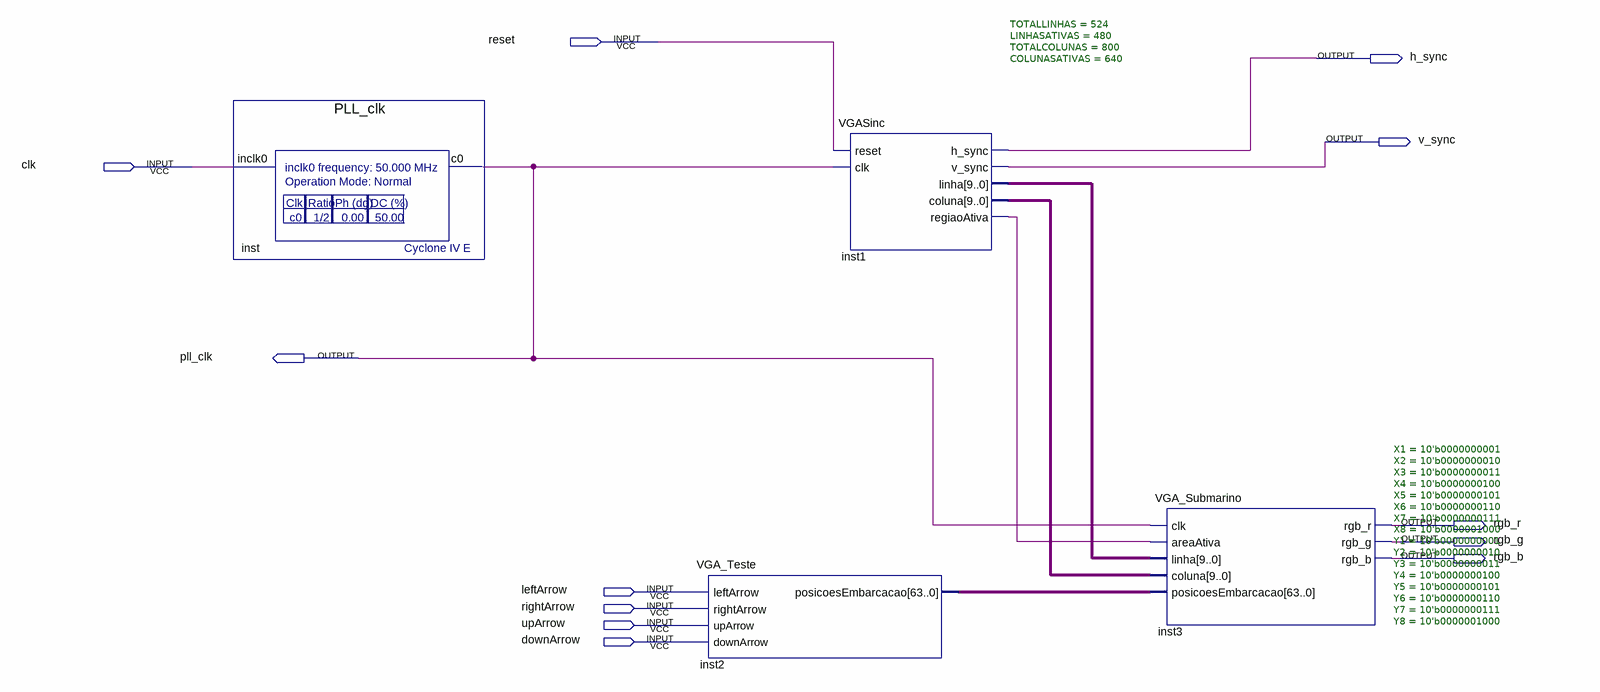
[diagram p0: schematic sheet]
// Quartus schematic VGA_pll_top.bdf as structural Verilog: 4 symbols, 12 pins
module VGA_pll_top (
  input  reset,
  input  clk,
  input  leftArrow,
  input  rightArrow,
  input  upArrow,
  input  downArrow,
  output h_sync,
  output v_sync,
  output pll_clk,
  output rgb_r,
  output rgb_g,
  output rgb_b
);

  wire inst1_regiaoativa;
  wire [9:0] inst1_coluna, inst1_linha;
  wire [63:0] inst2_posicoesembarcacao;

  PLL_clk inst (.inclk0(clk), .c0(pll_clk));
  VGA_Teste inst2 (
    .leftArrow(leftArrow), .rightArrow(rightArrow), .upArrow(upArrow), .downArrow(downArrow),
    .posicoesEmbarcacao(inst2_posicoesembarcacao));
  VGASinc #(.TOTALLINHAS(524), .LINHASATIVAS(480), .TOTALCOLUNAS(800), .COLUNASATIVAS(640)) inst1 (
    .reset(reset), .clk(pll_clk), .h_sync(h_sync), .v_sync(v_sync), .linha(inst1_linha),
    .coluna(inst1_coluna), .regiaoAtiva(inst1_regiaoativa));
  VGA_Submarino #(.X1(10'b0000000001), .X2(10'b0000000010), .X3(10'b0000000011), .X4(10'b0000000100), .X5(10'b0000000101), .X6(10'b0000000110), .X7(10'b0000000111), .X8(10'b0000001000), .Y1(10'b0000000001), .Y2(10'b0000000010), .Y3(10'b0000000011), .Y4(10'b0000000100), .Y5(10'b0000000101), .Y6(10'b0000000110), .Y7(10'b0000000111), .Y8(10'b0000001000)) inst3 (
    .clk(pll_clk), .areaAtiva(inst1_regiaoativa), .linha(inst1_linha), .coluna(inst1_coluna),
    .posicoesEmbarcacao(inst2_posicoesembarcacao), .rgb_r(rgb_r), .rgb_g(rgb_g), .rgb_b(rgb_b));
endmodule
